# Altium schematic sheet control_logic.SchDoc (part 1 of 2)
size 431 x 279 mm; Author: Pawel Bukowiec; Organization: ORGANIZATION; Address1: ADDRESS 1; Address2: ADDRESS 2; Address3: ADDRESS 3; Address4: ADDRESS 4; Revision: 1; SheetNumber: 3; SheetTotal: 5; ENG_APP_DATE: --/--/--; DSN_APP_DATE: --/--/--; CHK_APP_DATE: --/--/--; SPICEModelCacheQRXHUKIT: <root> / <DocumentId>QRXHUKIT</DocumentId> / <CacheFrame Number="0"> / <Model Name="1n4148" Kind="CKT"> / <Text>* / ******************************************* / * / *1N4148 / * / *NXP Semiconductors / * / *High-speed diodes / * / * / * / * / * / * / * / * / * / * / * / *VRRM = 100V / *IFRM = 450 mA / *trr  = 4ns / * / * / *Package pinning does not match Spice model pinning. / *Package: SOD 27 / * / *Package Pin 1 : Cathode / *Package Pin 2 : Anode / * / * / * / * / *Simulator: PSPICE / * / ******************************************* / *# / .SUBCKT 1N4148 1 2 / * / * The resistor R1 does not reflect / * a physical device. Instead it / * improves modeling in the reverse / * mode of operation. / * / R1 1 2 5.827E+9 / D1 1 2 1N4148 / * / .MODEL 1N4148 D / + IS = 4.352E-9 / + N = 1.906 / + BV = 110 / + IBV = 0.0001 / + RS = 0.6458 / + CJO = 7.048E-13 / + VJ = 0.869 / + M = 0.03 / + FC = 0.5 / + TT = 3.48E-9 / .ENDS</Text> / </Model> / <Model Name="vnse_0" Kind="CKT"> / <Text>.SUBCKT VNSE_0  1 2 / .PARAM FLW=10 / .PARAM NLF=100 / .PARAM NVR=11 / .PARAM GLF={PWR(FLW,0.25)*NLF/1164} / .PARAM RNV={1.184*PWR(NVR,2)} / .MODEL DVN D KF={PWR(FLW,0.5)/1E11} IS=1.0E-16 / I1 0 7 10E-3 / I2 0 8 10E-3 / D1 7 0 DVN / D2 8 0 DVN / E1 3 6 7 8 {GLF} / R1 3 0 1E9 / R2 3 0 1E9 / R3 3 6 1E9 / E2 6 4 5 0 10 / R4 5 0 {RNV} / R5 5 0 {RNV} / R6 3 4 1E9 / R7 4 0 1E9 / E3 1 2 3 4 1 / .ENDS VNSE_0</Text> / </Model> / <Model Name="vccs_lim_zo_0" Kind="CKT"> / <Text>.SUBCKT VCCS_LIM_ZO_0  VC+ VC- IOUT+ IOUT- / .PARAM GAIN = 10 / .PARAM IPOS = 10E3 / .PARAM INEG = -10E3 / G1 IOUT+ IOUT- VALUE={LIMIT(GAIN*V(VC+,VC-),INEG,IPOS)} / .ENDS</Text> / </Model> / <Model Name="vos_src_0" Kind="CKT"> / <Text>* / .SUBCKT VOS_SRC_0  V+ V- REF+ REF- / E1 V+ 1 TABLE {(V(REF+, V-))} = / +(0, 1.6E-3) / +(1, 1.6E-3) / +(1.3, 0) / +(5.5, 0) / E2 1 V- TABLE {(V(V-, REF-))}= / +(-0.7, -2E-4) / +(-0.5, -2E-4) / +(-0.4, 0) / +(5.5, 0) / .ENDS VOS_SRC_0</Text> / </Model> / <Model Name="vccs_limit_iq_0" Kind="CKT"> / <Text>.SUBCKT VCCS_LIMIT_IQ_0  VC+ VC- IOUT+ IOUT- / .PARAM GAIN = 1E-3 / G1 IOUT- IOUT+ VALUE={IF( (V(VC+,VC-)&lt;=0),0,GAIN*V(VC+,VC-) )} / .ENDS</Text> / </Model> / <Model Name="femt_0" Kind="CKT"> / <Text>.SUBCKT FEMT_0  1 2 / .PARAM FLWF=1E-3 / .PARAM NLFF=7 / .PARAM NVRF=7 / .PARAM GLFF={PWR(FLWF,0.25)*NLFF/1164} / .PARAM RNVF={1.184*PWR(NVRF,2)} / .MODEL DVNF D KF={PWR(FLWF,0.5)/1E11} IS=1.0E-16 / I1 0 7 10E-3 / I2 0 8 10E-3 / D1 7 0 DVNF / D2 8 0 DVNF / E1 3 6 7 8 {GLFF} / R1 3 0 1E9 / R2 3 0 1E9 / R3 3 6 1E9 / E2 6 4 5 0 10 / R4 5 0 {RNVF} / R5 5 0 {RNVF} / R6 3 4 1E9 / R7 4 0 1E9 / G1 1 2 3 4 1E-6 / .ENDS FEMT_0</Text> / </Model> / <Model Name="vccs_lim_2_0" Kind="CKT"> / <Text>.SUBCKT VCCS_LIM_2_0  VC+ VC- IOUT+ IOUT- / .PARAM GAIN = 24.63E-3 / .PARAM IPOS = 0.247 / .PARAM INEG = -0.247 / G1 IOUT+ IOUT- VALUE={LIMIT(GAIN*V(VC+,VC-),INEG,IPOS)} / .ENDS</Text> / </Model> / <Model Name="vccs_lim_1_0" Kind="CKT"> / <Text>.SUBCKT VCCS_LIM_1_0  VC+ VC- IOUT+ IOUT- / .PARAM GAIN = 1E-4 / .PARAM IPOS = .5 / .PARAM INEG = -.5 / G1 IOUT+ IOUT- VALUE={LIMIT(GAIN*V(VC+,VC-),INEG,IPOS)} / .ENDS</Text> / </Model> / <Model Name="clamp_amp_lo_0" Kind="CKT"> / <Text>.SUBCKT CLAMP_AMP_LO_0  VC+ VC- VIN COM VO+ VO- / .PARAM G=1 / GVO+ COM VO+ VALUE = {IF(V(VIN,COM)&gt;V(VC+,COM),((V(VIN,COM)-V(VC+,COM))*G),0)} / GVO- COM VO- VALUE = {IF(V(VIN,COM)&lt;V(VC-,COM),((V(VC-,COM)-V(VIN,COM))*G),0)} / .ENDS</Text> / </Model> / <Model Name="clamp_amp_hi_0" Kind="CKT"> / <Text>.SUBCKT CLAMP_AMP_HI_0  VC+ VC- VIN COM VO+ VO- / .PARAM G=10 / GVO+ COM VO+ VALUE = {IF(V(VIN,COM)&gt;V(VC+,COM),((V(VIN,COM)-V(VC+,COM))*G),0)} / GVO- COM VO- VALUE = {IF(V(VIN,COM)&lt;V(VC-,COM),((V(VC-,COM)-V(VIN,COM))*G),0)} / .ENDS</Text> / </Model> / <Model Name="vccs_lim_gr_0" Kind="CKT"> / <Text>.SUBCKT VCCS_LIM_GR_0  VC+ VC- IOUT+ IOUT- / .PARAM GAIN = 1 / .PARAM IPOS = 0.494 / .PARAM INEG = -0.494 / G1 IOUT+ IOUT- VALUE={LIMIT(GAIN*V(VC+,VC-),INEG,IPOS)} / .ENDS</Text> / </Model> / <Model Name="vccs_lim_4_0" Kind="CKT"> / <Text>.SUBCKT VCCS_LIM_4_0  VC+ VC- IOUT+ IOUT- / .PARAM GAIN = 1 / .PARAM IPOS = 0.228 / .PARAM INEG = -0.228 / G1 IOUT+ IOUT- VALUE={LIMIT(GAIN*V(VC+,VC-),INEG,IPOS)} / .ENDS</Text> / </Model> / <Model Name="vccs_lim_clawp_0" Kind="CKT"> / <Text>.SUBCKT VCCS_LIM_CLAWP_0  VC+ VC- IOUT+ IOUT- / G1 IOUT+ IOUT- TABLE {ABS(V(VC+,VC-))} = / +(0, 5E-5) / +(10, 1.38E-4 ) / +(20, 2.93E-4) / +(30, 4.78E-4) / +(40, 7.21E-4) / +(45, 8.95E-4) / +(47, 9.92E-4) / +(50, 1.24E-3) / +(52, 1.59E-3) / +(54, 2.23E-3) / .ENDS VCCS_LIM_CLAWP_0</Text> / </Model> / <Model Name="vccs_lim_clawn_0" Kind="CKT"> / <Text>.SUBCKT VCCS_LIM_CLAWN_0  VC+ VC- IOUT+ IOUT- / G1 IOUT+ IOUT- TABLE {ABS(V(VC+,VC-))} = / +(0, 5E-5 ) / +(10, 1.29E-4) / +(20, 2.77E-4) / +(30, 4.52E-4) / +(40, 6.77E-4) / +(45, 8.31E-4) / +(47, 9.09E-4) / +(50, 1.08E-3) / +(52, 1.3E-3) / +(54, 2.25E-3) / .ENDS VCCS_LIM_CLAWN_0</Text> / </Model> / <Model Name="vccs_lim_3_0" Kind="CKT"> / <Text>.SUBCKT VCCS_LIM_3_0  VC+ VC- IOUT+ IOUT- / .PARAM GAIN = 1 / .PARAM IPOS = 0.114 / .PARAM INEG = -0.114 / G1 IOUT+ IOUT- VALUE={LIMIT(GAIN*V(VC+,VC-),INEG,IPOS)} / .ENDS VCCS_LIM_3_0</Text> / </Model> / <Model Name="ol_sense_0" Kind="CKT"> / <Text>.SUBCKT OL_SENSE_0  COM SW+ OLN  OLP / GSW+ COM SW+ VALUE = {IF((V(OLN,COM)&gt;10E-3 | V(OLP,COM)&gt;10E-3),1,0)} / .ENDS</Text> / </Model> / <Model Name="vccs_ext_lim_0" Kind="CKT"> / <Text>.SUBCKT VCCS_EXT_LIM_0  VIN+ VIN- IOUT- IOUT+ VP+ VP- / .PARAM GAIN = 1 / G1 IOUT+ IOUT- VALUE={LIMIT(GAIN*V(VIN+,VIN-),V(VP-,VIN-), V(VP+,VIN-))} / .ENDS</Text> / </Model> / <Model Name="tlv9062" Kind="CKT"> / <Text>* TLV9062 - Rev. D / * Created by Paul Goedeke, Ian Williams; July 27, 2018 - Revised by GPAMPS Team; 2021-06-17 / * Created with Green-Williams-Lis Op Amp Macro-model Architecture / * Copyright 2018 by Texas Instruments Corporation / ****************************************************** / * MACRO-MODEL SIMULATED PARAMETERS: / ****************************************************** / * OPEN-LOOP GAIN AND PHASE VS. FREQUENCY  WITH RL, CL EFFECTS (Aol) / * UNITY GAIN BANDWIDTH (GBW) / * INPUT COMMON-MODE REJECTION RATIO VS. FREQUENCY (CMRR) / * POWER SUPPLY REJECTION RATIO VS. FREQUENCY (PSRR) / * DIFFERENTIAL INPUT IMPEDANCE (Zid) / * COMMON-MODE INPUT IMPEDANCE (Zic) / * OPEN-LOOP OUTPUT IMPEDANCE VS. FREQUENCY (Zo) / * OUTPUT CURRENT THROUGH THE SUPPLY (Iout) / * INPUT VOLTAGE NOISE DENSITY VS. FREQUENCY (en) / * INPUT CURRENT NOISE DENSITY VS. FREQUENCY (in) / * OUTPUT VOLTAGE SWING vs. OUTPUT CURRENT (Vo) / * SHORT-CIRCUIT OUTPUT CURRENT (Isc) / * QUIESCENT CURRENT (Iq) / * SETTLING TIME VS. CAPACITIVE LOAD (ts) / * SLEW RATE (SR) / * SMALL SIGNAL OVERSHOOT VS. CAPACITIVE LOAD / * LARGE SIGNAL RESPONSE / * OVERLOAD RECOVERY TIME (tor) / * INPUT BIAS CURRENT (Ib) / * INPUT OFFSET CURRENT (Ios) / * INPUT OFFSET VOLTAGE (Vos) / * INPUT COMMON-MODE VOLTAGE RANGE (Vcm) / * INPUT OFFSET VOLTAGE VS. INPUT COMMON-MODE VOLTAGE (Vos vs. Vcm) / * INPUT/OUTPUT ESD CELLS (ESDin, ESDout) / ****************************************************** / .subckt TLV9062 IN+ IN- VCC VEE OUT / ****************************************************** / * MODEL DEFINITIONS: / .model BB_SW VSWITCH(Ron=50 Roff=1e12 Von=700e-3 Voff=0) / .model ESD_SW VSWITCH(Ron=50 Roff=1e12 Von=250e-3 Voff=0) / .model OL_SW VSWITCH(Ron=1e-3 Roff=1e9 Von=900e-3 Voff=800e-3) / .model OR_SW VSWITCH(Ron=10e-3 Roff=1e9 Von=1e-3 Voff=0) / .model R_NOISELESS RES(T_ABS=-273.15) / ****************************************************** / I_OS        ESDn MID 450F / I_B         25 MID 500F / V_GRp       60 MID 60 / V_GRn       61 MID -60 / V_ISCp      54 MID 54 / V_ISCn      55 MID -54 / V_ORn       34 VCLP -1.5 / V11         59 33 0 / V_ORp       32 VCLP 1.5 / V12         58 31 0 / V4          47 OUT 0 / VCM_MIN     82 VEE_B -100M / VCM_MAX     83 VCC_B 100M / I_Q         VCC VEE 538U / V_OS        26 37 282.259U / C30         21 MID  3.18000000000000E-0016 / R69         MID 21 R_NOISELESS 1MEG / G7          21 MID 22 MID  -1U / C29         22 MID 1.56F / R80         MID 22 R_NOISELESS 1MEG / G19         22 MID 23 MID  -1U / R51         ESDp 24 R_NOISELESS 1M / XVOS_VCM    25 26 VCC VEE VOS_SRC_0 / S5          VEE ESDp VEE ESDp  S_VSWITCH_1 / S4          VEE ESDn VEE ESDn  S_VSWITCH_2 / S2          ESDn VCC ESDn VCC  S_VSWITCH_3 / S3          ESDp VCC ESDp VCC  S_VSWITCH_4 / C28         27 MID 1P / R72         28 27 R_NOISELESS 100 / C27         29 MID 1P / R71         30 29 R_NOISELESS 100 / R75         MID 31 R_NOISELESS 1 / G14         31 MID 32 MID  -1 / R74         33 MID R_NOISELESS 1 / G13         33 MID 34 MID  -1 / R89         35 MID R_NOISELESS 1 / XVCCS_LIM_ZO 36 MID MID 35 VCCS_LIM_ZO_0 / Xi_nn       ESDn MID FEMT_0 / Xi_np       MID 37 FEMT_0 / Xe_n        24 37 VNSE_0 / C26         23 MID 3.18F / R79         MID 23 R_NOISELESS 1MEG / G18         23 MID VSENSE MID  -1U / C36         CLAMP MID 39.2N / R68         MID CLAMP R_NOISELESS 1MEG / XVCCS_LIM_2 38 MID MID CLAMP VCCS_LIM_2_0 / R44         MID 38 R_NOISELESS 1MEG / XVCCS_LIM_1 39 40 MID 38 VCCS_LIM_1_0 / R72_2       36 MID R_NOISELESS 1.11K / C31         36 41 15.92F / R87         36 41 R_NOISELESS 10K / R86         41 MID R_NOISELESS 1 / Gb1         41 MID 42 MID  -1 / C22         43 MID 45F / R85         42 43 R_NOISELESS 10K / R84         42 44 R_NOISELESS 90K / R83         44 MID R_NOISELESS 1 / G21         44 MID 45 MID  -6.5 / C21         46 45 1.59U / R55         45 MID R_NOISELESS 1.82K / R54         45 46 R_NOISELESS 10K / Rdummy      MID 47 R_NOISELESS 4K / Rx          47 35 R_NOISELESS 40K / Rdc2        46 MID R_NOISELESS 1 / G10         46 MID CL_CLAMP 47  -60.61 / R46         MID 48 R_NOISELESS 3.572K / C14         48 49 15.9P / R48         49 48 R_NOISELESS 100MEG / G6          49 MID VEE_B MID  -99.34M / Rsrc1       MID 49 R_NOISELESS 1 / R49         MID 50 R_NOISELESS 3.572K / C16         50 51 15.9P / R50         51 50 R_NOISELESS 100MEG / G9          51 MID VCC_B MID  -99.34M / Rsrc2       MID 51 R_NOISELESS 1 / R81         MID 52 R_NOISELESS 6K / C20         52 53 265.3F / R82         53 52 R_NOISELESS 100MEG / G20         53 MID ESDp MID  -2.089 / Rsrc3       MID 53 R_NOISELESS 1 / XIQPos      VIMON MID MID VCC VCCS_LIMIT_IQ_0 / XIQNeg      MID VIMON VEE MID VCCS_LIMIT_IQ_0 / C_DIFF      ESDp ESDn 2P / XCL_AMP     54 55 VIMON MID 56 57 CLAMP_AMP_LO_0 / S8          CLAMP 58 CLAMP 58  S_VSWITCH_5 / S9          59 CLAMP 59 CLAMP  S_VSWITCH_6 / XGR_AMP     60 61 62 MID 63 64 CLAMP_AMP_HI_0 / R39         60 MID R_NOISELESS 1T / R37         61 MID R_NOISELESS 1T / R42         VSENSE 62 R_NOISELESS 1M / C19         62 MID 1F / R38         63 MID R_NOISELESS 1 / R36         MID 64 R_NOISELESS 1 / R40         63 65 R_NOISELESS 1M / R41         64 66 R_NOISELESS 1M / C17         65 MID 1F / C18         MID 66 1F / XGR_SRC     65 66 CLAMP MID VCCS_LIM_GR_0 / R21         56 MID R_NOISELESS 1 / R20         MID 57 R_NOISELESS 1 / R29         56 67 R_NOISELESS 1M / R30         57 68 R_NOISELESS 1M / C9          67 MID 1F / C8          MID 68 1F / XCL_SRC     67 68 CL_CLAMP MID VCCS_LIM_4_0 / R22         54 MID R_NOISELESS 1T / R19         MID 55 R_NOISELESS 1T / XCLAWp      VIMON MID 69 VCC_B VCCS_LIM_CLAWP_0 / XCLAWn      MID VIMON VEE_B 70 VCCS_LIM_CLAWN_0 / R12         69 VCC_B R_NOISELESS 1K / R16         69 71 R_NOISELESS 1M / R13         VEE_B 70 R_NOISELESS 1K / R17         72 70 R_NOISELESS 1M / C6          72 MID 1F / C5          MID 71 1F / G2          VCC_CLP MID 71 MID  -1M / R15         VCC_CLP MID R_NOISELESS 1K / G3          VEE_CLP MID 72 MID  -1M / R14         MID VEE_CLP R_NOISELESS 1K / XCLAW_AMP   VCC_CLP VEE_CLP VOUT_S MID 73 74 CLAMP_AMP_LO_0 / R26         VCC_CLP MID R_NOISELESS 1T / R23         VEE_CLP MID R_NOISELESS 1T / R25         73 MID R_NOISELESS 1 / R24         MID 74 R_NOISELESS 1 / R27         73 75 R_NOISELESS 1M / R28         74 76 R_NOISELESS 1M / C11         75 MID 1F / C10         MID 76 1F / XCLAW_SRC   75 76 CLAW_CLAMP MID VCCS_LIM_3_0 / H2          30 MID V11 -1 / H3          28 MID V12 1 / C12         SW_OL MID 1N / R32         77 SW_OL R_NOISELESS 100 / R31         77 MID R_NOISELESS 1 / XOL_SENSE   MID 77 29 27 OL_SENSE_0 / S1          46 45 SW_OL MID  S_VSWITCH_7 / H1          78 MID V4 1K / S7          VEE OUT VEE OUT  S_VSWITCH_8 / S6          OUT VCC OUT VCC  S_VSWITCH_9 / R11         MID 79 R_NOISELESS 1T / R18         79 VOUT_S R_NOISELESS 100 / C7          VOUT_S MID 1P / E5          79 MID OUT MID  1 / C13         VIMON MID 10P / R33         78 VIMON R_NOISELESS 100 / R10         MID 78 R_NOISELESS 1T / R47         80 VCLP R_NOISELESS 100 / C24         VCLP MID 100P / E4          80 MID CL_CLAMP MID  1 / R62         MID CL_CLAMP R_NOISELESS 1K / G4          CL_CLAMP MID CLAW_CLAMP MID  -1M / R45         MID CLAW_CLAMP R_NOISELESS 1K / G8          CLAW_CLAMP MID 21 MID  -1M / R43         MID VSENSE R_NOISELESS 1K / G15         VSENSE MID CLAMP MID  -1M / C4          39 MID 1F / R9          39 81 R_NOISELESS 1M / R7          MID 82 R_NOISELESS 1T / R6          83 MID R_NOISELESS 1T / R8          MID 81 R_NOISELESS 1 / XVCM_CLAMP  84 MID 81 MID 83 82 VCCS_EXT_LIM_0 / E1          MID 0 85 0  1 / R77         VEE_B 0 R_NOISELESS 1 / R5          86 VEE_B R_NOISELESS 1M / C3          86 0 1F / R60         85 86 R_NOISELESS 1MEG / C1          85 0 100e-9 / R3          85 0 R_NOISELESS 1T / R59         87 85 R_NOISELESS 1MEG / C2          87 0 1F / R4          VCC_B 87 R_NOISELESS 1M / R76         VCC_B 0 R_NOISELESS 1 / G17         VEE_B 0 VEE 0  -1 / G16         VCC_B 0 VCC 0  -1 / R67         88 84 R_NOISELESS 1K / G1          84 88 50 48  -1M / R2          40 ESDn R_NOISELESS 1M / R1          88 89 R_NOISELESS 1M / R58         25 89 R_NOISELESS 1K / G5          89 25 52 MID  -1M / C_CMn       ESDn MID 4P / C_CMp       MID ESDp 4P / R53         ESDn MID R_NOISELESS 1T / R52         MID ESDp R_NOISELESS 1T / R35         IN- ESDn R_NOISELESS 10M / R34         IN+ ESDp R_NOISELESS 10M / .MODEL S_VSWITCH_1 VSWITCH (RON=50 ROFF=1T VON=500M VOFF=100M) / .MODEL S_VSWITCH_2 VSWITCH (RON=50 ROFF=1T VON=500M VOFF=100M) / .MODEL S_VSWITCH_3 VSWITCH (RON=50 ROFF=1T VON=500M VOFF=100M) / .MODEL S_VSWITCH_4 VSWITCH (RON=50 ROFF=1T VON=500M VOFF=100M) / .MODEL S_VSWITCH_5 VSWITCH (RON=10M ROFF=1T VON=10M VOFF=0) / .MODEL S_VSWITCH_6 VSWITCH (RON=10M ROFF=1T VON=10M VOFF=0) / .MODEL S_VSWITCH_7 VSWITCH (RON=1M ROFF=1T VON=500M VOFF=100M) / .MODEL S_VSWITCH_8 VSWITCH (RON=50 ROFF=1T VON=500M VOFF=100M) / .MODEL S_VSWITCH_9 VSWITCH (RON=50 ROFF=1T VON=500M VOFF=100M) / .ENDS TLV9062</Text> / <Dependency>0\vnse_0</Dependency> / <Dependency>0\vccs_lim_zo_0</Dependency> / <Dependency>0\vos_src_0</Dependency> / <Dependency>0\vccs_limit_iq_0</Dependency> / <Dependency>0\femt_0</Dependency> / <Dependency>0\vccs_lim_2_0</Dependency> / <Dependency>0\vccs_lim_1_0</Dependency> / <Dependency>0\clamp_amp_lo_0</Dependency> / <Dependency>0\clamp_amp_hi_0</Dependency> / <Dependency>0\vccs_lim_gr_0</Dependency> / <Dependency>0\vccs_lim_4_0</Dependency> / <Dependency>0\vccs_lim_clawp_0</Dependency> / <Dependency>0\vccs_lim_clawn_0</Dependency> / <Dependency>0\vccs_lim_3_0</Dependency> / <Dependency>0\ol_sense_0</Dependency> / <Dependency>0\vccs_ext_lim_0</Dependency> / </Model> / <Model Name="lm4040_na2p5" Kind="CKT"> / <Text>* PSpice Model Editor - Version 16.0.0 / *$ / *LM4040_N / ***************************************************************************** / *  (C) Copyright 2013 Texas Instruments Incorporated. All rights reserved. / ***************************************************************************** / ** This model is designed as an aid for customers of Texas Instruments. / ** TI and its licensors and suppliers make no warranties, either expressed / ** or implied, with respect to this model, including the warranties of / ** merchantability or fitness for a particular purpose.  The model is / ** provided solely on an "as is" basis.  The entire risk as to its quality / ** and performance is with the customer / ***************************************************************************** / * / ** Released by: WEBENCH Design Center,Texas Instruments Inc. / * Part: LM4040_N / * Date: 10APR2013 / * Model Type: TRANSIENT / * Simulator: PSPICE / * Simulator Version: 16.0.0 / * EVM Order Number: N/A / * EVM Users Guide: N/A / * Datasheet: SNOS633G–MAY 2004–REVISED JULY 2012 / * / * Model Version: Final 1.00 / * / ***************************************************************************** / * / * Updates: / * / * Final 1.00 / * Release to Web. / * / ****************************************************************************** / .SUBCKT LM4040_NA2P5  V+ V- PARAMS: TOL=0 / C_Cstart         V- START  	100nF  TC=0,0 / Q_Q22         N03098 N01931 V- NPN1X / Q_Q7         N02184 VC_Q2 N01786 NPN1X / Q_Q12         N02229 N03098 N04190 NPN1X / Q_Q13         N04160 N04160 N04190 NPN1X 10 / Q_Q3         VC_Q3 VB_Q3 VE NPN1X 10 / Q_Q5         VC_Q3 N01129 N01136 PNPL1X 1.8 / Q_Q6         N01129 N01129 N01136 PNPL1X 1.8 / C_C3         N03098 N01136  3pF  TC=0,0 / Q_Q23         N01136 N01136 N08107 NPN1X / R_R10         N01129 N01786  60K TC=0,0 / Q_Q15         N04160 N02229 N01136 PNPL1X 10 / R_R1toR5         N07686 N01136  30.5K TC=0,0 / R_R15         N01931 Q20B  66K TC=0,0 / Q_Q14         N02229 N02229 N01136 PNPL1X 1 / Q_Q20         N01533 Q20B V- NPN1X / R_R6         VB_Q2 N07686  20K TC=0,0 / C_Cx         V- N01136  1pF  TC=0,0 / C_C2         VC_Q3 N02514  6pF  TC=0,0 / E_Estart         N30465 V- VALUE { max(0.4*(1-V(VB_Q2, VB_Q3)/.05), 0)+V(Q20B) / +  } / Q_Q1         V- FB_TEMP Q1E PNPV1X 5 / Q_Q17         N01533 FB_TEMP Q1E PNPL1X 1 / R_Rx6         V+ N01136  1000 TC=0,0 / Q_Q19         Q20B VE N08426 PNPL1X 1 / R_R8         Q1E VB_Q3  45K TC=0,0 / Q_Q16         N01136 N04160 V- NPN1X 10 / Q_Q4         VC_Q2 N01129 N01136 PNPL1X 1.8 / R_R13         Q20B N01533  40K TC=0,0 / R_Rstart0         START N30465 180 TC=0,0 / R_R11         N02514 N02184  100K TC=0,0 / R_R14         N01755 V-  3.3K TC=0,0 / Q_Q11         N03098 N02514 N01136 PNPL1X 1.8 / Q_Q21         N01786 Q20B N01755 NPN1X 6.75 / Q_Q24         N01136 N07686 N08116 NPN1X / Q_Q8         N02514 VC_Q3 N01786 NPN1X / Q_Q2         VC_Q2 VB_Q2 VE NPN1X / Q_Q10         N02514 N02184 N01136 PNPL1X 3.1 / Q_Q9         N02184 N02184 N01136 PNPL1X 3.1 / R_R18         Q1E N08116  69K TC=0,0 / R_R59         N01136 N08426  51K TC=0,0 / R_R12         N01505 V-  6K TC=0,0 / L_Lx1         N01136 V+  10uH / R_R16         N04190 V-  1K TC=0,0 / Q_Q18         VE Q20B N01505 NPN1X / R_Rstart1         Q20B START  20K TC=0,0 / R_R17         N08116 N08107  130k TC=0,0 / R_R7         VB_Q3 VB_Q2  10K TC=0,0 / C_C1         VC_Q2 N03098  3pF  TC=0,0 / R_R19       V+ FB_TEMP  {IF({TOL}==0,483.14225k,IF({TOL}&gt;0,4.826578E5,4.836267E5))} / R_R20       FB_TEMP V-  500K / .model NPN1X	NPN Is=13.84e-18 Bf=130 TR=8ns / .model PNPV1X	PNP Is=261.8e-18 Bf=222 / .model PNPL1X	PNP  Is=48e-18 Bf=63 / .model Menable NMOS LEVEL 1 / + VTO 0 / + KP 20.000000E-06 / + PHI 0.6 / + IS 10.000000E-15 / + PB     .8 / + PBSW     .8 / + UCRIT   10.000000E+03 / + DIOMOD    1 / *+ VDD    5 / *+ XPART    0 / * / * / .model Dideal D Is=0.001p N=0.01 Rs=0 Ikf=0 Xti=2 Eg=1.11 Cjo=0 / +               M=0.33 Vj=1 Fc=0.5 Isr=0.1n Nr=2 Bv=75 Ibv=1e-10 Tt=0 / * / * / .ENDS  LM4040_NA2P5</Text> / </Model> / <Model Name="prop_delay" Kind="CKT"> / <Text>.SUBCKT Prop_Delay VIN VOUT / T_TPD         N03175 0 VOUT 0 Z0=50 TD=39n / R_RT         0 VOUT  50 TC=0,0 / R_RS         N03175 VIN  50 TC=0,0 / .ENDS</Text> / </Model> / <Model Name="vinrange_393" Kind="CKT"> / <Text>*$ / .SUBCKT VINRANGE_393 1 2 OUT VDD VSS / EOUT OUT2 0 VALUE = { IF( ( V(1) &gt;= V(2) ), V(VSS), V(VDD) ) } / R1 OUT2 OUT 1 / C1 OUT 0 1e-12 / .ENDS</Text> / </Model> / <Model Name="4orgate" Kind="CKT"> / <Text>.SUBCKT 4ORGATE 1 2 3 4 5 VDD VSS / E1 6 0 VALUE = { IF( ((V(1)&gt; (V(VDD)+V(VSS))/2 ) | (V(2)&gt; (V(VDD)+V(VSS))/2 ) | (V(3)&gt; (V(VDD)+V(VSS))/2 ) | (V(4)&gt; (V(VDD)+V(VSS))/2 )), V(VDD), V(VSS) ) } / R1 5 6 1 / .ENDS</Text> / </Model> / <Model Name="inputrange" Kind="CKT"> / <Text>.SUBCKT INPUTRANGE INN INP INRANGE V+_BUFFER V-_BUFFER / V_VCMNP         N20415 V-_BUFFER -0.2 / V_VCMPN         N202710 V+_BUFFER 0.2 / X_U1         N20155 INP N20826 V+_BUFFER V-_BUFFER VINRANGE_393 / V_VCMPP         N20155 V+_BUFFER 0.2 / V_VCMNN         N20539 V-_BUFFER -0.2 / X_U21         N202710 INN N20833 V+_BUFFER V-_BUFFER VINRANGE_393 / X_U22         INP N20415 N20840 V+_BUFFER V-_BUFFER VINRANGE_393 / X_U23         INN N20539 N20531 V+_BUFFER V-_BUFFER VINRANGE_393 / X_U24         N20826 N20833 N20840 N20531 INRANGE V+_BUFFER V-_BUFFER 4ORGATE / .ENDS</Text> / <Dependency>0\vinrange_393</Dependency> / <Dependency>0\4orgate</Dependency> / </Model> / <Model Name="output_stage_smid" Kind="CKT"> / <Text>.subckt Output_Stage_SMID 1 2 3 4 / S_SMID         3 4 1 2 _SMID / RS_SMID         1 2 1G / .MODEL         _SMID VSWITCH Roff=1e12 Ron=1.0 Voff=1 Von=0 / .ends Output_Stage_SMID</Text> / </Model> / <Model Name="diglevshift" Kind="CKT"> / <Text>*$ / .SUBCKT DIGLEVSHIFT 1 2 VDD_OLD VSS_OLD VDD_NEW VSS_NEW / *E1 3 0 VALUE = { IF( V(1) &lt; (V(VDD_OLD)+V(VSS_OLD))/2, V(VSS_NEW), V(VDD_NEW) ) } / E1 3 0 VALUE = { IF( V(1) &lt; 1, V(VSS_NEW), V(VDD_NEW) ) } / R1 3 2 1 / *C1 2 0 1e-12 / .ENDS</Text> / </Model> / <Model Name="inverter" Kind="CKT"> / <Text>*$ / .SUBCKT INVERTER 1 2 VDD VSS / E2 2 0 VALUE = { IF( V(1)&gt; (V(VDD)+V(VSS))/2, V(VSS), V(VDD) ) } / C1 1 0 1e-12 / .ENDS</Text> / </Model> / <Model Name="output_stage_shiz" Kind="CKT"> / <Text>.subckt Output_Stage_SHIZ 1 2 3 4 / S_SHIZ         3 4 1 2 _SHIZ / RS_SHIZ         1 2 1G / .MODEL         _SHIZ VSWITCH Roff=1e12 Ron=1.0 Voff=1 Von=0 / .ends Output_Stage_SHIZ</Text> / </Model> / <Model Name="mid_supply" Kind="CKT"> / <Text>*$ / .SUBCKT MID_SUPPLY OUT VDD VSS / EVMID VMID 0 VALUE = { ( V(VDD) + V(VSS) )/2 } / EOUT OUT 0 VALUE = {V(VMID)} / .ENDS</Text> / </Model> / <Model Name="output_stage_svol" Kind="CKT"> / <Text>.subckt Output_Stage_SVOL 1 2 3 4 / S_SVOL         3 4 1 2 _SVOL / RS_SVOL         1 2 1G / .MODEL         _SVOL VSWITCH Roff=1e12 Ron=1.0 Voff=1 Von=0 / .ends Output_Stage_SVOL</Text> / </Model> / <Model Name="orgate" Kind="CKT"> / <Text>*$ / .SUBCKT ORGATE 1 2 3 VDD VSS / E1 4 0 VALUE = { IF( ((V(1)&lt; (V(VDD)+V(VSS))/2 ) &amp; (V(2)&lt; (V(VDD)+V(VSS))/2 )), V(VSS), V(VDD) ) } / R1 4 3 1 / C1 3 0 1e-12 / .ENDS</Text> / </Model> / <Model Name="output_stage_svoh" Kind="CKT"> / <Text>.subckt Output_Stage_SVOH 1 2 3 4 / S_SVOH         3 4 1 2 _SVOH / RS_SVOH         1 2 1G / .MODEL         _SVOH VSWITCH Roff=1e12 Ron=1.0 Voff=0 Von=1 / .ends Output_Stage_SVOH</Text> / </Model> / <Model Name="output_stage" Kind="CKT"> / <Text>.SUBCKT Output_Stage EN GND IN_RANGE POR V+_BUFFER V-_BUFFER Vcc VIN VOUT / X_SMID    CONTROL_MID 0 N778484 MID Output_Stage_SMID / X_U3         VIN N774212 V+_BUFFER V-_BUFFER VCC N774290 DIGLEVSHIFT / X_U7         MID V+_BUFFER V-_BUFFER MID_SUPPLY / V_VLOGIC         1V 0 1 / V_V1         VCC N774290 1 / X_SHIZ    CONTROL_HIZ 0 N778484 N778496 Output_Stage_SHIZ / X_U8          POR IN_RANGE EN EN CONTROL_HIZ 1V 0 4ORGATE / X_U9         CONTROL_HIZ N789513 1V 0 INVERTER / X_U10         N789513 POR CONTROL_MID 1V 0 ORGATE / L_L1         N778484 VOUT  1n / C_COUTH         VOUT VCC  0.5p  TC=0,0 / C_COUTL         GND VOUT  0.5p  TC=0,0 / X_SVOL    N774212 N774290 GND N850209 Output_Stage_SVOL / R_ROUTL         N850209 N778496  60 TC=0,0 / R_ROUTH         N778496 N8552942  60 TC=0,0 / X_SVOH    N774212 N774290 N8552942 VCC Output_Stage_SVOH / .ENDS</Text> / <Dependency>0\output_stage_smid</Dependency> / <Dependency>0\diglevshift</Dependency> / <Dependency>0\inverter</Dependency> / <Dependency>0\output_stage_shiz</Dependency> / <Dependency>0\mid_supply</Dependency> / <Dependency>0\4orgate</Dependency> / <Dependency>0\output_stage_svol</Dependency> / <Dependency>0\orgate</Dependency> / <Dependency>0\output_stage_svoh</Dependency> / </Model> / <Model Name="supply_buffer1" Kind="CKT"> / <Text>*$ / .SUBCKT SUPPLY_BUFFER1 1 2 VDD_NEW VSS_NEW / EVDD_NEW VDD_NEW 0 VALUE = {V(1)} / EVSS_NEW VSS_NEW 0 VALUE = {V(2)} / .ENDS</Text> / </Model> / <Model Name="input_buffer" Kind="CKT"> / <Text>.SUBCKT Input_Buffer IN+ IN+_BUFF IN- IN-_BUFF / X_U1         IN+ IN- IN+_BUFF IN-_BUFF SUPPLY_BUFFER1 / .ENDS</Text> / <Dependency>0\supply_buffer1</Dependency> / </Model> / <Model Name="supply_buffer" Kind="CKT"> / <Text>.SUBCKT Supply_Buffer GND V+_BUFFER V-_BUFFER Vcc / X_U1         VCC GND V+_BUFFER V-_BUFFER SUPPLY_BUFFER1 / .ENDS</Text> / <Dependency>0\supply_buffer1</Dependency> / </Model> / <Model Name="vcc_range" Kind="CKT"> / <Text>*$ / .SUBCKT VCC_Range 1 2 OUT VDD VSS / EOUT OUT2 0 VALUE = { IF( ( V(1) &gt;= V(2) ), V(VDD), V(VSS) ) } / R1 OUT OUT2 1 / C1 OUT 0 1e-12 / .ENDS</Text> / </Model> / <Model Name="difference" Kind="CKT"> / <Text>*$ / .SUBCKT Difference 1 2 OUT VDD VSS / EOUT OUT1 0 VALUE = { V(1)- V(2)} / R1 OUT1 OUT 1 / *C1 OUT 0 1e-12 / .ENDS</Text> / </Model> / <Model Name="supply_enable" Kind="CKT"> / <Text>.SUBCKT Supply_Enable EN POR V+_BUFFER V-_BUFFER / V_VS_MIN_SET         N785045 0 2.69 / X_U15         N785045 N784647 POR 1V 0 VCC_Range / X_U13         V+_BUFFER V-_BUFFER N784647 1V 0 Difference / X_U17         N784661 N784771 EN 1V 0 ORGATE / V_VLOGIC         1V 0 1 / X_U16         N784873 N784647 N784771 1V 0 VCC_Range / V_VS_MAX_SET         N784557 V-_BUFFER 5.5 / X_U5         N784647 N784557 N784661 1V 0 VCC_Range / V_VS_MIN_SET1         N784873 V-_BUFFER 2.69 / .ENDS</Text> / <Dependency>0\vcc_range</Dependency> / <Dependency>0\difference</Dependency> / <Dependency>0\orgate</Dependency> / </Model> / <Model Name="hpa_comphys" Kind="CKT"> / <Text>*$ / .SUBCKT HPA_COMPHYS INP INN OUT_OUT VDD VSS VHYS / EVMID VMID 0 VALUE = { ( V(VDD) + V(VSS) )/2 } / EVH VH 0 VALUE = { ( V(VHYS)/2) } / EINNNEW INNNEW 0 VALUE = { IF( ( V(OUT_OUT) &lt; V(VMID) ),(V(INN) + (V(VH))),( V(INN) - V(VH) ) ) } / EOUT OUT 0 VALUE = { IF( ( V(INP) &gt; V(INNNEW) ), V(VDD), V(VSS) ) } / R1 OUT OUT_OUT 1 / C1 OUT_OUT 0 1e-12 / .ENDS</Text> / </Model> / <Model Name="tlv3201" Kind="CKT"> / <Text>* source TLV3201 / * PSpice Model Editor - Version 17.4.0 / *$ / * TLV3201 / ***************************************************************************** / * (C) Copyright 2019 Texas Instruments Incorporated. All rights reserved. / ***************************************************************************** / ** This model is designed as an aid for customers of Texas Instruments. / ** TI and its licensors and suppliers make no warranties, either expressed / ** or implied, with respect to this model, including the warranties of / ** merchantability or fitness for a particular purpose.  The model is / ** provided solely on an "as is" basis.  The entire risk as to its quality / ** and performance is with the customer. / ***************************************************************************** / * / * This model is subject to change without notice. Texas Instruments / * Incorporated is not responsible for updating this model / * / ***************************************************************************** / * / ** Released by: Texas Instruments Inc. / * Part: TLV3201 / * Date: 07/01/2021 / * Model Type: All In One / * Simulator: PSPICE / * Simulator Version: 17.2.0.p001 / * EVM Order Number: N/A / * EVM Users Guide:  N/A / * Datasheet: SBOSS561B - MARCH 2012 - REVISED DECEMBER 2016 / * / * Model Version: 1.0 / * / ***************************************************************************** / * / * Updates: / * / * Version 1.0 : Release to Web / * / ***************************************************************************** / * Notes: / * The following parameters are modeled: / * Iq, tpd, Ibias, Vcm, Vs, Vhys / * If the supply goes beyond the recommended maximum range, outputs will float to mid supply / * If one input goes beyond the recommended operating range, the output will float to mid supply / * / ***************************************************************************** / * source TLV3201 / .SUBCKT TLV3201 IN+ IN- Vcc GND OUT / X_U4 N21103 N840186 Prop_Delay / X_U2 IN-BUFF IN+BUFF N21168 V+_BUFFER V-_BUFFER INPUTRANGE / X_U5 N21237 GND N21168 0 V+_BUFFER V-_BUFFER VCC N840186 OUT Output_Stage / X_U6 GND V+_BUFFER V-_BUFFER VCC Supply_Buffer / X_U3         N785573 IN-BUFF N21103 V+_BUFFER V-_BUFFER N852568 HPA_COMPHYS / I_IS         N843683 GND DC 40u / X_U7 N21237 0 V+_BUFFER V-_BUFFER Supply_Enable / X_U1 IN+ IN+BUFF IN- IN-BUFF Input_Buffer / I_IBP         IN+ GND DC 1p / I_IBN         IN- GND DC 1p / V_VOS         N785573 IN+BUFF 1m / R_RIS         N843683 VCC  1u TC=0,0 / C_CINPL         GND IN+  0.5p  TC=0,0 / C_CINNL         GND IN-  0.5p  TC=0,0 / C_CINPH         IN+ VCC  0.5p  TC=0,0 / C_CINNH         IN- VCC  0.5p  TC=0,0 / V_VHYST         N852568 0 1.2m / .ENDS</Text> / <Dependency>0\prop_delay</Dependency> / <Dependency>0\inputrange</Dependency> / <Dependency>0\output_stage</Dependency> / <Dependency>0\input_buffer</Dependency> / <Dependency>0\supply_buffer</Dependency> / <Dependency>0\supply_enable</Dependency> / <Dependency>0\hpa_comphys</Dependency> / </Model> / <Model Name="logic_input_lvc_1i_and_pp_st_sn74lvc2g17" Kind="CKT"> / <Text>.SUBCKT LOGIC_INPUT_LVC_1i_AND_PP_ST_SN74LVC2G17 OUT IN VCC VEE / .PARAM STANDARD_INPUT_SELECT = 0 / .PARAM SCHMITT_TRIGGER_INPUT_SELECT = 1 / ESTD_THR VSTD_THR VEE TABLE {V(VCC,VEE)} = / +(1,0.5) / +(1.8,0.9) / +(2.5,1.25) / +(3.3,1.65) / +(5,2.5) / +(6,3) / ETRP_P VTRP_P VEE TABLE {V(VCC,VEE)} = / +(1.65,0.9) / +(2.3,1.25) / +(3,1.7) / +(4.5,2.45) / +(5.5,3) / ETRP_N VTRP_N VEE TABLE {V(VCC,VEE)} = / +(1.65,0.45) / +(2.3,0.7) / +(3,1.05) / +(4.5,1.72) / +(5.5,2.1) / EHYST VHYST VEE TABLE {V(VCC,VEE)} = / +(1.65,0.45) / +(2.3,0.55) / +(3,0.65) / +(4.5,0.73) / +(5.5,0.9) / ETRUE NTRUE VEE VALUE = {V(VCC,VEE)} / EFALSE NFALSE VEE VALUE = {0} / EBETA BETA VEE VALUE = {V(VHYST,VEE)/(V(NTRUE,VEE) - V(NFALSE,VEE) + V(VHYST,VEE))} / EFB NFB VEE VALUE = {(1 - V(BETA,VEE))*V(IN,VEE) + V(BETA,VEE)*V(CURR_OUT,VEE)} / EREF NREF VEE VALUE = {0.5*(1 - V(BETA,VEE))*(V(VTRP_P,VEE) + V(VTRP_N,VEE)) / + + 0.5*V(BETA,VEE)*(V(NTRUE,VEE) + V(NFALSE,VEE))} / EDIFF NDIFF VEE VALUE = {V(NFB,NREF)} / ESWITCH VSWITCH VEE VALUE = {0.5*(-SGN(V(NDIFF,VEE)) + ABS(SGN(V(NDIFF,VEE))))} / ESWITCH1 VSWITCH1 VEE VALUE = {0.5*(SGN(V(NDIFF,VEE)) + ABS(SGN(V(NDIFF,VEE))))} / GCOMP VEE CURR_OUT VALUE = {SCHMITT_TRIGGER_INPUT_SELECT*0.5*V(VCC,VEE)*(SGN(V(NDIFF,VEE)) + ABS(SGN(V(NDIFF,VEE))))} / GSTD VEE CURR_OUT VALUE = {STANDARD_INPUT_SELECT*0.5*V(VCC,VEE)*(SGN(V(IN,VSTD_THR)) + ABS(SGN(V(IN,VSTD_THR))))} / ROUT CURR_OUT VEE 1 / EMID MID VEE VALUE = {0.5*(V(VCC,VEE) + V(VEE))} / EARG NARG VEE VALUE = {V(CURR_OUT,VEE) - V(MID,VEE)} / EOUT OUT VEE VALUE = {0.5*(SGN(V(NARG,VEE)) + ABS(SGN(V(NARG,VEE) ) ) )} / .PARAM MAXICC = 0.032 / .PARAM VT = .7 / .PARAM VCC_MIN = 1.65 / EV_VT1 VTN VEE VALUE = { VT } / EV_VT2 VTP VEE VALUE = { V(VCC,VEE) - VT } / ETEST TEST VEE VALUE = {.9*V(VCC,VEE)} / EVTHDIFF VTH_DIFF VEE VALUE = {V(IN,VSTD_THR)} / EVTHPDIFF VTHP_DIFF VEE VALUE = {V(IN,VTRP_P)} / EVTHNDIFF VTHN_DIFF VEE VALUE = {V(IN,VTRP_N)} / EVTNDIFF VTN_DIFF VEE VALUE = { V(IN,VTN) } / EVTPDIFF VTP_DIFF VEE VALUE = { V(IN,VTP) } / GICCVA VCC VEE VALUE = { (-ABS(( (1+SGN(V(VTN_DIFF,VEE)) ) )/2 -1) * / + 2*MAXICC*((V(IN,VEE)-VT)/V(VCC,VEE))^2)*(1 + SGN(V(VCC,VEE) - VCC_MIN))*V(VSWITCH,VEE)} / GICCVB VCC VEE VALUE = { (ABS(( (1+SGN(V(VTHP_DIFF,VEE)) ) )/2 -1) * / + 2*MAXICC*((V(IN,VEE)-VT)/V(VCC,VEE))^2)*(1 + SGN(V(VCC,VEE) - VCC_MIN))*V(VSWITCH,VEE)} / GICCVC VCC VEE VALUE = { ( ABS(  (1+SGN(V(VTHN_DIFF,VEE)) ) )/2  * / + 2*MAXICC*((V(IN,VEE)-(V(VCC,VEE)-VT))/V(VCC,VEE))^2)*(1 + SGN(V(VCC,VEE) - VCC_MIN))*V(VSWITCH1,VEE)} / GICCVD VCC VEE VALUE = { (-ABS(  (1+SGN(V(VTP_DIFF,VEE)) ) )/2  * / + 2*MAXICC*((V(IN,VEE)-(V(VCC,VEE)-VT))/V(VCC,VEE))^2)*(1 + SGN(V(VCC,VEE) - VCC_MIN))*V(VSWITCH1,VEE)} / .ENDS</Text> / </Model> / <Model Name="logic_icc_lvc_1i_and_pp_st_sn74lvc2g17" Kind="CKT"> / <Text>.SUBCKT LOGIC_ICC_LVC_1i_AND_PP_ST_SN74LVC2G17 VCC VEE VIOUT / .PARAM ICC = 2.5e-07 / .PARAM VCC_MAX = 5.5 / .PARAM VCC_MIN = 1.65 / GICC VCC VEE VALUE = {ICC*0.5*(1 + SGN(V(VCC,VEE) - VCC_MIN))} / EGNDF GNDF 0 VALUE = {0.5*(V(VCC) + V(VEE))} / GOUTP VCC GNDF VALUE = {V(VIOUT,VEE)*0.5*(SGN(V(VIOUT,VEE)) + ABS(SGN(V(VIOUT,VEE))))} / GOUTN GNDF VEE VALUE = {V(VIOUT,VEE)*0.5*(SGN(V(VIOUT,VEE)) + ABS(SGN(V(VIOUT,VEE))))} / .ENDS</Text> / </Model> / <Model Name="logic_function_2_lvc_1i_and_pp_st_sn74lvc2g17" Kind="CKT"> / <Text>.SUBCKT LOGIC_FUNCTION_2_LVC_1i_AND_PP_ST_SN74LVC2G17 A B OUT VCC VEE / .PARAM AND  = 1 / .PARAM NAND = 0 / .PARAM OR   = 0 / .PARAM NOR  = 0 / .PARAM XOR  = 0 / .PARAM XNOR = 0 / GAND  VEE N1 VALUE = {AND*V(A,VEE)*V(B,VEE)} / GNAND VEE N1 VALUE = {NAND*(1 - V(A,VEE)*V(B,VEE))} / GOR   VEE N1 VALUE = {OR*(MIN(V(A,VEE) + V(B,VEE),1))} / GNOR  VEE N1 VALUE = {NOR*(1 - MIN(V(A,VEE) + V(B,VEE),1))} / GXOR  VEE N1 VALUE = {XOR*((1 - V(A,VEE))*V(B,VEE) + V(A,VEE)*(1 - V(B,VEE)))} / GXNOR VEE N1 VALUE = {XNOR*(1 - ((1 - V(A,VEE))*V(B,VEE) + V(A,VEE)*(1 - V(B,VEE))))} / RN1 N1 VEE 1 / EOUT OUT VEE N1 VEE 1 / .ENDS</Text> / </Model> / <Model Name="tpd_lvc_1i_and_pp_st_sn74lvc2g17" Kind="CKT"> / <Text>.SUBCKT TPD_LVC_1i_AND_PP_ST_SN74LVC2G17 IN OUT VCC VEE / .PARAM TPDELAY1 = 1N / .PARAM RS = 10K / .PARAM CS = {-TPDELAY1/(RS*LOG(0.5))} / ETPDNORM NTPDNORM VEE TABLE {V(VCC,VEE)} = / +(1.8,4.3) / +(2.5,2.6) / +(3.3,2.15) / +(5,1.95) / G1 IN N1 VALUE = {V(IN,N1)/(V(NTPDNORM,VEE)*RS)} / RZ IN N1 10G / C1 N1 VEE {CS} / E1 N2 VEE VALUE = {0.5*(1 + SGN(V(N1,VEE) - 0.5))} / EOUT OUT VEE N2 VEE 1 / .ENDS</Text> / </Model> / <Model Name="logic_pp_output_lvc_1i_and_pp_st_sn74lvc2g17" Kind="CKT"> / <Text>.SUBCKT LOGIC_PP_OUTPUT_LVC_1i_AND_PP_ST_SN74LVC2G17 IN OUT VCC VEE / EROH NROH VEE TABLE {V(VCC,VEE)} = / +(1.65,112.5) / +(2.3,50) / +(3,37.5) / +(4.5,21.875) / EROL NROL VEE TABLE {V(VCC,VEE)} = / +(1.65,112.5) / +(2.3,37.5) / +(3,25) / +(4.5,17.1875) / E1 N1 VEE VALUE = {V(VCC,VEE)*V(IN,VEE)} / GOUT N1 OUT VALUE = {V(N1,OUT)*(V(IN,VEE)/V(NROH,VEE) + (1 - V(IN,VEE))/V(NROL,VEE))} / .ENDS</Text> / </Model> / <Model Name="logic_gate_2pin_od_lvc_1i_and_pp_st_sn74lvc2g17" Kind="CKT"> / <Text>.SUBCKT LOGIC_GATE_2PIN_OD_LVC_1i_AND_PP_ST_SN74LVC2G17 OUT A B VCC GND / .PARAM VCC_ABS_MAX = 6.5 / .PARAM VCC_MAX = 5.5 / .PARAM RA = 220000000 / .PARAM RB = 220000000 / .PARAM CA = 4.5e-12 / .PARAM CB = 4.5e-12 / .PARAM ROEZ = 5500000 / .PARAM COEZ = 6e-12 / RA  A  GND {RA} / RB  B  GND {RB} / CA  A  GND {CA} / CB  B  GND {CB} / XUA NA A VCC GND LOGIC_INPUT_LVC_1i_AND_PP_ST_SN74LVC2G17 / XUB NB B VCC GND LOGIC_INPUT_LVC_1i_AND_PP_ST_SN74LVC2G17 / XUG NA NB NOUTG VCC GND LOGIC_FUNCTION_2_LVC_1i_AND_PP_ST_SN74LVC2G17 / XOUTPD NOUTG NOUTTPD VCC GND TPD_LVC_1i_AND_PP_ST_SN74LVC2G17 / XUOUT NOUTTPD NOUT_INT VCC GND LOGIC_PP_OUTPUT_LVC_1i_AND_PP_ST_SN74LVC2G17 / XICC VCC GND NVIOUT LOGIC_ICC_LVC_1i_AND_PP_ST_SN74LVC2G17 / SICC VCC GND VCC GND SW1 / H1 NVIOUT GND VIOUT 1 / VIOUT NOUT_INT OUTsw 0 / SIOFF OUTsw OUT VCC GND SW2 / DA2 GND A D1 / DB2 GND B D1 / DO2 GND OUT D1 / RDA1 NA1 GND 1e6 / SDA1 NA1 A VCC GND SW2 / RDB1 NB1 GND 1e6 / SDB1 NB1 B VCC GND SW2 / RDO1 NO1 GND 1e6 / SDO1 NO1 OUT VCC GND SW2 / .MODEL SW1 VSWITCH VON = {VCC_ABS_MAX} VOFF = {VCC_MAX} RON = 10 ROFF = 60e6 / .MODEL SW2 VSWITCH VON = {0.55} VOFF = {0.45} RON = 10m ROFF = 100e6 / .MODEL D1 D / .ENDS</Text> / <Dependency>0\logic_input_lvc_1i_and_pp_st_sn74lvc2g17</Dependency> / <Dependency>0\logic_icc_lvc_1i_and_pp_st_sn74lvc2g17</Dependency> / <Dependency>0\logic_function_2_lvc_1i_and_pp_st_sn74lvc2g17</Dependency> / <Dependency>0\tpd_lvc_1i_and_pp_st_sn74lvc2g17</Dependency> / <Dependency>0\logic_pp_output_lvc_1i_and_pp_st_sn74lvc2g17</Dependency> / </Model> / <Model Name="sn74lvc2g17" Kind="CKT"> / <Text>******************************************************************************** / * SN74LVC2G17.cir / * 2.0 / * 2019-11-14 00:00:00 / * Texas Instruments Incorporated. / * Standard Logic, SLHR / * 12500 TI Blvd / * Dallas, TX -75243 / * / * Revision History: / * Rev 2.0: 01/01/2019 / * - Model generated from datasheet values / * - Built using generic logic gate behavioral pspice model V2 / * - Built using an automated model which generalizes parts under same family / * - Performance is expected typical behavior at 25C / * - Written for and tested with Tina-TI Version 9.3.100.244 SF-TI / * - Accurate power consumption with dyanmic as well as static Icc / * / ******************************************************************************** / *[Disclaimer] / * This model is designed as an aid for customers of Texas Instruments. / * TI and its licensors and suppliers make no warranties, either expressed / * or implied, with respect to this  model, including the warranties of / * merchantability or fitness for a particular purpose. The model is / * provided solely on an "as is" basis. The entire risk as to its quality / * and performance is with the customer. / * / *[Copyright] / *(C) Copyright 2019 Texas Instruments Incorporated.All rights reserved. / * / * / ******************************************************************************** / *                                 SN74LVC2G17 / ******************************************************************************** / .SUBCKT SN74LVC2G17 1Y 2Y 1A 2A VCC AGND / XU1 1Y 1A VCC VCC AGND LOGIC_GATE_2PIN_OD_LVC_1i_AND_PP_ST_SN74LVC2G17 / XU2 2Y 2A VCC VCC AGND LOGIC_GATE_2PIN_OD_LVC_1i_AND_PP_ST_SN74LVC2G17 / .ENDS</Text> / <Dependency>0\logic_gate_2pin_od_lvc_1i_and_pp_st_sn74lvc2g17</Dependency> / </Model> / <Model Name="logic_input_lvc_2i_nand_pp_cmos_sn74ahc1g00" Kind="CKT"> / <Text>.SUBCKT LOGIC_INPUT_LVC_2i_NAND_PP_CMOS_SN74AHC1G00 OUT IN VCC VEE / .PARAM STANDARD_INPUT_SELECT = 1 / .PARAM SCHMITT_TRIGGER_INPUT_SELECT = 0 / ESTD_THR VSTD_THR VEE TABLE {V(VCC,VEE)} = / +(1,0.5) / +(1.8,0.9) / +(2.5,1.25) / +(3.3,1.65) / +(5,2.5) / +(6,3) / ETRP_P VTRP_P VEE TABLE {V(VCC,VEE)} = / +(3,1.2) / +(4.5,1.75) / +(5.5,2.15) / ETRP_N VTRP_N VEE TABLE {V(VCC,VEE)} = / +(3,0.9) / +(4.5,1.35) / +(5.5,1.65) / EHYST VHYST VEE TABLE {V(VCC,VEE)} = / +(3,0.3) / +(4.5,0.4) / +(5.5,0.5) / ETRUE NTRUE VEE VALUE = {V(VCC,VEE)} / EFALSE NFALSE VEE VALUE = {0} / EBETA BETA VEE VALUE = {V(VHYST,VEE)/(V(NTRUE,VEE) - V(NFALSE,VEE) + V(VHYST,VEE))} / EFB NFB VEE VALUE = {(1 - V(BETA,VEE))*V(IN,VEE) + V(BETA,VEE)*V(CURR_OUT,VEE)} / EREF NREF VEE VALUE = {0.5*(1 - V(BETA,VEE))*(V(VTRP_P,VEE) + V(VTRP_N,VEE)) / + + 0.5*V(BETA,VEE)*(V(NTRUE,VEE) + V(NFALSE,VEE))} / EDIFF NDIFF VEE VALUE = {V(NFB,NREF)} / ESWITCH VSWITCH VEE VALUE = {0.5*(-SGN(V(NDIFF,VEE)) + ABS(SGN(V(NDIFF,VEE))))} / ESWITCH1 VSWITCH1 VEE VALUE = {0.5*(SGN(V(NDIFF,VEE)) + ABS(SGN(V(NDIFF,VEE))))} / GCOMP VEE CURR_OUT VALUE = {SCHMITT_TRIGGER_INPUT_SELECT*0.5*V(VCC,VEE)*(SGN(V(NDIFF,VEE)) + ABS(SGN(V(NDIFF,VEE))))} / GSTD VEE CURR_OUT VALUE = {STANDARD_INPUT_SELECT*0.5*V(VCC,VEE)*(SGN(V(IN,VSTD_THR)) + ABS(SGN(V(IN,VSTD_THR))))} / ROUT CURR_OUT VEE 1 / EMID MID VEE VALUE = {0.5*(V(VCC,VEE) + V(VEE))} / EARG NARG VEE VALUE = {V(CURR_OUT,VEE) - V(MID,VEE)} / EOUT OUT VEE VALUE = {0.5*(SGN(V(NARG,VEE)) + ABS(SGN(V(NARG,VEE) ) ) )} / .PARAM MAXICC = .0009 / .PARAM VT = .7 / .PARAM VCC_MIN = 3 / EV_VT1 VTN VEE VALUE = { VT } / EV_VT2 VTP VEE VALUE = { V(VCC,VEE) - VT } / ETEST TEST VEE VALUE = {.9*V(VCC,VEE)} / EVTHDIFF VTH_DIFF VEE VALUE = {V(IN,VSTD_THR)} / EVTHPDIFF VTHP_DIFF VEE VALUE = {V(IN,VTRP_P)} / EVTHNDIFF VTHN_DIFF VEE VALUE = {V(IN,VTRP_N)} / EVTNDIFF VTN_DIFF VEE VALUE = { V(IN,VTN) } / EVTPDIFF VTP_DIFF VEE VALUE = { V(IN,VTP) } / GICCVA VCC VEE VALUE = { (-ABS(( (1+SGN(V(VTN_DIFF,VEE)) ) )/2 -1) * / + 2*MAXICC*((V(IN,VEE)-VT)/V(VCC,VEE))^2)*(1 + SGN(V(VCC,VEE) - VCC_MIN))*V(VSWITCH,VEE)} / GICCVB VCC VEE VALUE = { (ABS(( (1+SGN(V(VTHP_DIFF,VEE)) ) )/2 -1) * / + 2*MAXICC*((V(IN,VEE)-VT)/V(VCC,VEE))^2)*(1 + SGN(V(VCC,VEE) - VCC_MIN))*V(VSWITCH,VEE)} / GICCVC VCC VEE VALUE = { ( ABS(  (1+SGN(V(VTHN_DIFF,VEE)) ) )/2  * / + 2*MAXICC*((V(IN,VEE)-(V(VCC,VEE)-VT))/V(VCC,VEE))^2)*(1 + SGN(V(VCC,VEE) - VCC_MIN))*V(VSWITCH1,VEE)} / GICCVD VCC VEE VALUE = { (-ABS(  (1+SGN(V(VTP_DIFF,VEE)) ) )/2  * / + 2*MAXICC*((V(IN,VEE)-(V(VCC,VEE)-VT))/V(VCC,VEE))^2)*(1 + SGN(V(VCC,VEE) - VCC_MIN))*V(VSWITCH1,VEE)} / .ENDS</Text> / </Model> / <Model Name="logic_function_2_lvc_2i_nand_pp_cmos_sn74ahc1g00" Kind="CKT"> / <Text>.SUBCKT LOGIC_FUNCTION_2_LVC_2i_NAND_PP_CMOS_SN74AHC1G00 A B OUT VCC VEE / .PARAM AND  = 0 / .PARAM NAND = 1 / .PARAM OR   = 0 / .PARAM NOR  = 0 / .PARAM XOR  = 0 / .PARAM XNOR = 0 / GAND  VEE N1 VALUE = {AND*V(A,VEE)*V(B,VEE)} / GNAND VEE N1 VALUE = {NAND*(1 - V(A,VEE)*V(B,VEE))} / GOR   VEE N1 VALUE = {OR*(MIN(V(A,VEE) + V(B,VEE),1))} / GNOR  VEE N1 VALUE = {NOR*(1 - MIN(V(A,VEE) + V(B,VEE),1))} / GXOR  VEE N1 VALUE = {XOR*((1 - V(A,VEE))*V(B,VEE) + V(A,VEE)*(1 - V(B,VEE)))} / GXNOR VEE N1 VALUE = {XNOR*(1 - ((1 - V(A,VEE))*V(B,VEE) + V(A,VEE)*(1 - V(B,VEE))))} / RN1 N1 VEE 1 / EOUT OUT VEE N1 VEE 1 / .ENDS</Text> / </Model> / <Model Name="tpd_lvc_2i_nand_pp_cmos_sn74ahc1g00" Kind="CKT"> / <Text>.SUBCKT TPD_LVC_2i_NAND_PP_CMOS_SN74AHC1G00 IN OUT VCC VEE / .PARAM TPDELAY1 = 1N / .PARAM RS = 10K / .PARAM CS = {-TPDELAY1/(RS*LOG(0.5))} / ETPDNORM NTPDNORM VEE TABLE {V(VCC,VEE)} = / +(3.3,6.7) / +(5,4.7) / G1 IN N1 VALUE = {V(IN,N1)/(V(NTPDNORM,VEE)*RS)} / RZ IN N1 10G / C1 N1 VEE {CS} / E1 N2 VEE VALUE = {0.5*(1 + SGN(V(N1,VEE) - 0.5))} / EOUT OUT VEE N2 VEE 1 / .ENDS</Text> / </Model> / <Model Name="logic_pp_output_lvc_2i_nand_pp_cmos_sn74ahc1g00" Kind="CKT"> / <Text>.SUBCKT LOGIC_PP_OUTPUT_LVC_2i_NAND_PP_CMOS_SN74AHC1G00 IN OUT VCC VEE / EROH NROH VEE TABLE {V(VCC,VEE)} = / +(2,2000) / +(3,105) / +(4.5,70) / EROL NROL VEE TABLE {V(VCC,VEE)} = / +(2,2000) / +(3,90) / +(4.5,46.25) / E1 N1 VEE VALUE = {V(VCC,VEE)*V(IN,VEE)} / GOUT N1 OUT VALUE = {V(N1,OUT)*(V(IN,VEE)/V(NROH,VEE) + (1 - V(IN,VEE))/V(NROL,VEE))} / .ENDS</Text> / </Model> / <Model Name="logic_icc_lvc_2i_nand_pp_cmos_sn74ahc1g00" Kind="CKT"> / <Text>.SUBCKT LOGIC_ICC_LVC_2i_NAND_PP_CMOS_SN74AHC1G00 VCC VEE VIOUT / .PARAM ICC = 5e-09 / .PARAM VCC_MAX = 5.5 / .PARAM VCC_MIN = 2 / GICC VCC VEE VALUE = {ICC*0.5*(1 + SGN(V(VCC,VEE) - VCC_MIN))} / EGNDF GNDF 0 VALUE = {0.5*(V(VCC) + V(VEE))} / GOUTP VCC GNDF VALUE = {V(VIOUT,VEE)*0.5*(SGN(V(VIOUT,VEE)) + ABS(SGN(V(VIOUT,VEE))))} / GOUTN GNDF VEE VALUE = {V(VIOUT,VEE)*0.5*(SGN(V(VIOUT,VEE)) + ABS(SGN(V(VIOUT,VEE))))} / .ENDS</Text> / </Model> / <Model Name="logic_gate_2pin_od_lvc_2i_nand_pp_cmos_sn74ahc1g00" Kind="CKT"> / <Text>.SUBCKT LOGIC_GATE_2PIN_OD_LVC_2i_NAND_PP_CMOS_SN74AHC1G00 OUT A B VCC GND / .PARAM VCC_ABS_MAX = 7 / .PARAM VCC_MAX = 5.5 / .PARAM RA = 2200000000 / .PARAM RB = 2200000000 / .PARAM CA = 1e-11 / .PARAM CB = 1e-11 / .PARAM ROEZ = 2000.0000000000016 / .PARAM COEZ = 1e-11 / RA  A  GND {RA} / RB  B  GND {RB} / CA  A  GND {CA} / CB  B  GND {CB} / XUA NA A VCC GND LOGIC_INPUT_LVC_2i_NAND_PP_CMOS_SN74AHC1G00 / XUB NB B VCC GND LOGIC_INPUT_LVC_2i_NAND_PP_CMOS_SN74AHC1G00 / XUG NA NB NOUTG VCC GND LOGIC_FUNCTION_2_LVC_2i_NAND_PP_CMOS_SN74AHC1G00 / XOUTPD NOUTG NOUTTPD VCC GND TPD_LVC_2i_NAND_PP_CMOS_SN74AHC1G00 / XUOUT NOUTTPD NOUT_INT VCC GND LOGIC_PP_OUTPUT_LVC_2i_NAND_PP_CMOS_SN74AHC1G00 / XICC VCC GND NVIOUT LOGIC_ICC_LVC_2i_NAND_PP_CMOS_SN74AHC1G00 / SICC VCC GND VCC GND SW1 / H1 NVIOUT GND VIOUT 1 / VIOUT NOUT_INT OUTsw 0 / SIOFF OUTsw OUT VCC GND SW2 / DA2 GND A D1 / DB2 GND B D1 / DO2 GND OUT D1 / RDA1 NA1 GND 1e6 / SDA1 NA1 A VCC GND SW2 / RDB1 NB1 GND 1e6 / SDB1 NB1 B VCC GND SW2 / RDO1 NO1 GND 1e6 / SDO1 NO1 OUT VCC GND SW2 / .MODEL SW1 VSWITCH VON = {VCC_ABS_MAX} VOFF = {VCC_MAX} RON = 10 ROFF = 60e6 / .MODEL SW2 VSWITCH VON = {0.55} VOFF = {0.45} RON = 10m ROFF = 100e6 / .MODEL D1 D / .ENDS</Text> / <Dependency>0\logic_input_lvc_2i_nand_pp_cmos_sn74ahc1g00</Dependency> / <Dependency>0\logic_function_2_lvc_2i_nand_pp_cmos_sn74ahc1g00</Dependency> / <Dependency>0\tpd_lvc_2i_nand_pp_cmos_sn74ahc1g00</Dependency> / <Dependency>0\logic_pp_output_lvc_2i_nand_pp_cmos_sn74ahc1g00</Dependency> / <Dependency>0\logic_icc_lvc_2i_nand_pp_cmos_sn74ahc1g00</Dependency> / </Model> / <Model Name="sn74ahc1g00" Kind="CKT"> / <Text>.SUBCKT SN74AHC1G00 Y A B VCC AGND / XU1 Y A B VCC AGND LOGIC_GATE_2PIN_OD_LVC_2i_NAND_PP_CMOS_SN74AHC1G00 / .ENDS</Text> / <Dependency>0\logic_gate_2pin_od_lvc_2i_nand_pp_cmos_sn74ahc1g00</Dependency> / </Model> / </CacheFrame> / </root>
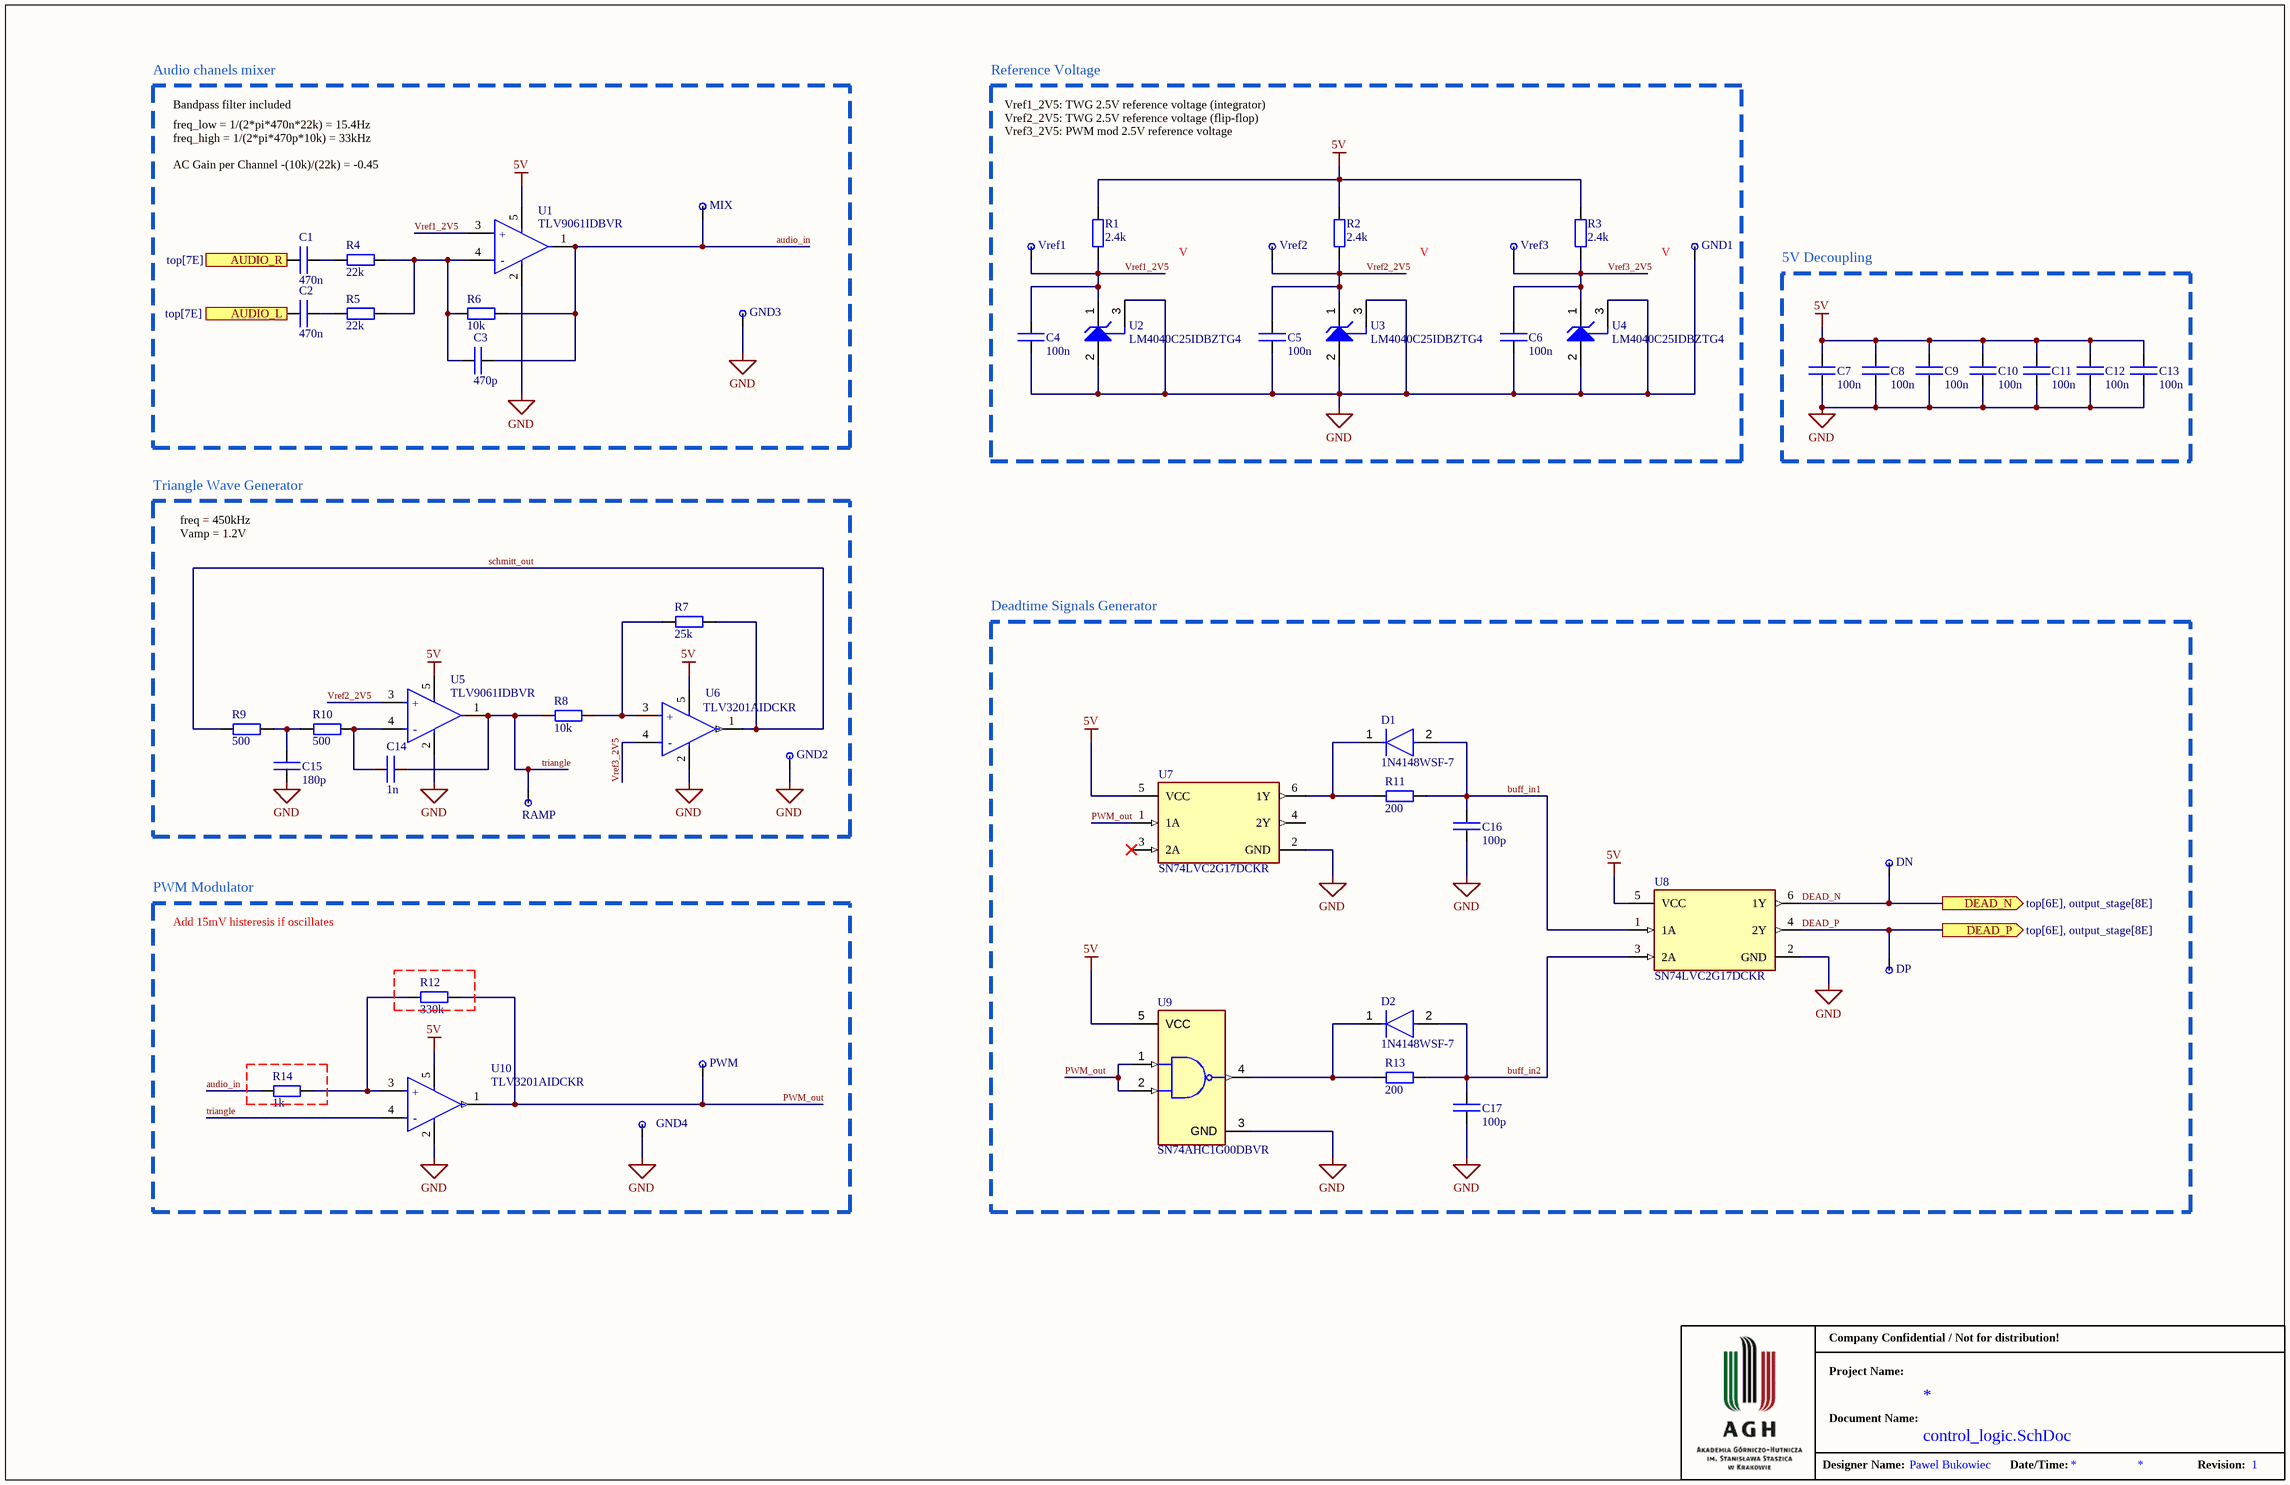
[diagram p0: control_logic.SchDoc]

## Parts
C1  470n  [CAP_1206]
C2  470n  [CAP_1206]
C3  470p  [CAP_IPC_0805_133A]
C4  100n  [CAP_IPC_0805_133A]
C5  100n  [CAP_IPC_0805_133A]
C6  100n  [CAP_IPC_0805_133A]
C7  100n  [CAP_IPC_0805_133A]
C8  100n  [CAP_IPC_0805_133A]
C9  100n  [CAP_IPC_0805_133A]
C10  100n  [CAP_IPC_0805_133A]
C11  100n  [CAP_IPC_0805_133A]
C12  100n  [CAP_IPC_0805_133A]
C13  100n  [CAP_IPC_0805_133A]
C14  1n  [CAP_IPC_0805_133A]
C15  180p  [CAP_IPC_0805_133A]
C16  100p  [CAP_IPC_0805_133A]
C17  100p  [CAP_IPC_0805_133A]
D1  1N4148WSF-7  [1N4148]
D2  1N4148WSF-7  [1N4148]
DN  TestPoint  [TestPoint_SMT]  (value not drawn)
DP  TestPoint  [TestPoint_SMT]  (value not drawn)
GND1  TestPoint  [TestPoint_SMT]  (value not drawn)
GND2  TestPoint  [TestPoint_SMT]  (value not drawn)
GND3  TestPoint  [TestPoint_SMT]  (value not drawn)
GND4  TestPoint  [TestPoint_SMT]  (value not drawn)
MIX  TestPoint  [TestPoint_SMT]  (value not drawn)
PWM  TestPoint  [TestPoint_SMT]  (value not drawn)
R1  2.4k  [RES_VJ_0402_MD]
R2  2.4k  [RES_VJ_0402_MD]
R3  2.4k  [RES_VJ_0402_MD]
R4  22k  [RES_VJ_0402_MD]
R5  22k  [RES_VJ_0402_MD]
R6  10k  [RES_VJ_0402_MD]
R7  25k  [RES_VJ_0402_MD]
R8  10k  [RES_VJ_0402_MD]
R9  500  [RES_VJ_0402_MD]
R10  500  [RES_VJ_0402_MD]
R11  200  [RES_VJ_0402_MD]
R12  330k  [RES_VJ_0402_MD]
R13  200  [RES_VJ_0402_MD]
R14  1k  [RES_VJ_0402_MD]
RAMP  TestPoint  [TestPoint_SMT]  (value not drawn)
U1  TLV9061IDBVR  [TLV9061]
U2  LM4040C25IDBZTG4  [LM4040C25]
U3  LM4040C25IDBZTG4  [LM4040C25]
U4  LM4040C25IDBZTG4  [LM4040C25]
U5  TLV9061IDBVR  [TLV9061]
U6  TLV3201AIDCKR  [TLV3201]
U7  SN74LVC2G17DCKR  [SN74LVC2G17DCKR]
U8  SN74LVC2G17DCKR  [SN74LVC2G17DCKR]
U9  SN74AHC1G00DBVR  [SN74AHC1G00DBVR]
U10  TLV3201AIDCKR  [TLV3201]
Vref1  TestPoint  [TestPoint_SMT]  (value not drawn)
Vref2  TestPoint  [TestPoint_SMT]  (value not drawn)
Vref3  TestPoint  [TestPoint_SMT]  (value not drawn)

## Blocks framed on the sheet
Audio chanels mixer: C1-C3 GND3 MIX R4-R6 U1
Reference Voltage: C4-C6 GND1 R1-R3 U2-U4 Vref1-Vref3
5V Decoupling: C7-C13
Triangle Wave Generator: C14 C15 GND2 R7-R10 RAMP U5 U6
Deadtime Signals Generator: C16 C17 D1 D2 DN DP R11 R13 U7-U9
PWM Modulator: GND4 PWM R12 R14 U10

## Ports
AUDIO_L (in, see top[7E]), AUDIO_R (in, see top[7E]), DEAD_N (out, see top[6E], output_stage[8E]), DEAD_P (out, see top[6E], output_stage[8E])

## Nets
5V: C7.1 C8.1 C9.1 C10.1 C11.1 C12.1 C13.1 R1.1 R2.1 R3.1 U1.5(V+) U5.5(V+) U6.5(VCC) U7.5(VCC) U8.5(VCC) U9.5(VCC) U10.5(VCC)
GND: C4.2 C5.2 C6.2 C7.2 C8.2 C9.2 C10.2 C11.2 C12.2 C13.2 C15.2 C16.2 C17.2 GND1.1 GND2.1 GND3.1 GND4.1 U1.2(V-) U2.2(ANODE) U2.3(NC) U3.2(ANODE) U3.3(NC) U4.2(ANODE) U4.3(NC) U5.2(V-) U6.2(GND) U7.2(GND) U8.2(GND) U9.3(GND) U10.2(GND)
audio_in: C3.2 MIX.1 R6.2 R14.1 U1.1(OUT)
AUDIO_L: C2.1 ; port AUDIO_L
AUDIO_R: C1.1 ; port AUDIO_R
buff_in1: C16.1 D1.2(A) R11.2 U8.1(1A)
buff_in2: C17.1 D2.2(A) R13.2 U8.3(2A)
DEAD_N: DN.1 U8.6(1Y) ; port DEAD_N
DEAD_P: DP.1 U8.4(2Y) ; port DEAD_P
PWM_out: PWM.1 R12.2 U7.1(1A) U9.1(A) U9.2(B) U10.1(OUT)
schmitt_out: R7.2 R9.1 U6.1(OUT)
triangle: C14.2 R8.1 RAMP.1 U5.1(OUT) U10.4(IN-)
Vref1_2V5: C4.1 R1.2 U1.3(IN+) U2.1(CATHODE) Vref1.1
Vref2_2V5: C5.1 R2.2 U3.1(CATHODE) U5.3(IN+) Vref2.1
Vref3_2V5: C6.1 R3.2 U4.1(CATHODE) U6.4(IN-) Vref3.1
NetC1_2: C1.2 R4.1
NetC2_2: C2.2 R5.1
NetC3_1: C3.1 R4.2 R5.2 R6.1 U1.4(IN-)
NetC14_1: C14.1 R10.2 U5.4(IN-)
NetC15_1: C15.1 R9.2 R10.1
NetD1_1: D1.1(C) R11.1 U7.6(1Y)
NetD2_1: D2.1(C) R13.1 U9.4(Y)
NetR7_1: R7.1 R8.2 U6.3(IN+)
NetR12_1: R12.1 R14.2 U10.3(IN+)

Not connected (* = marked no-connect by the designer): U7 3(2A)* 4(2Y)

## Notes on the sheet
- Bandpass filter included
- freq_low = 1/(2*pi*470n*22k) = 15.4Hz
- freq_high = 1/(2*pi*470p*10k) = 33kHz
- AC Gain per Channel -(10k)/(22k) = -0.45
- Vref1_2V5: TWG 2.5V reference voltage (integrator)
- Vref2_2V5: TWG 2.5V reference voltage (flip-flop)
- Vref3_2V5: PWM mod 2.5V reference voltage
- freq = 450kHz
- Vamp = 1.2V
- Add 15mV histeresis if oscillates
- Project Name:
- Company Confidential / Not for distribution!
- Document Name:
- Designer Name:
- Date/Time:
- Revision:
- (in symbol TLV3201) +
- (in symbol TLV9061) +; -